# EasyEDA Pro project ProPrj_3x3motorFPGA_V2_1_2025-08-05.epro, schematic motor_drv
Create Date: 2025-05-27; Page Name: P1; Project Name: 3x3motors_d; Schematic Name: motor_drv; Update Date: 2025-05-28; Company: EasyEDA.com; Page Size: A4; Version: V1.0
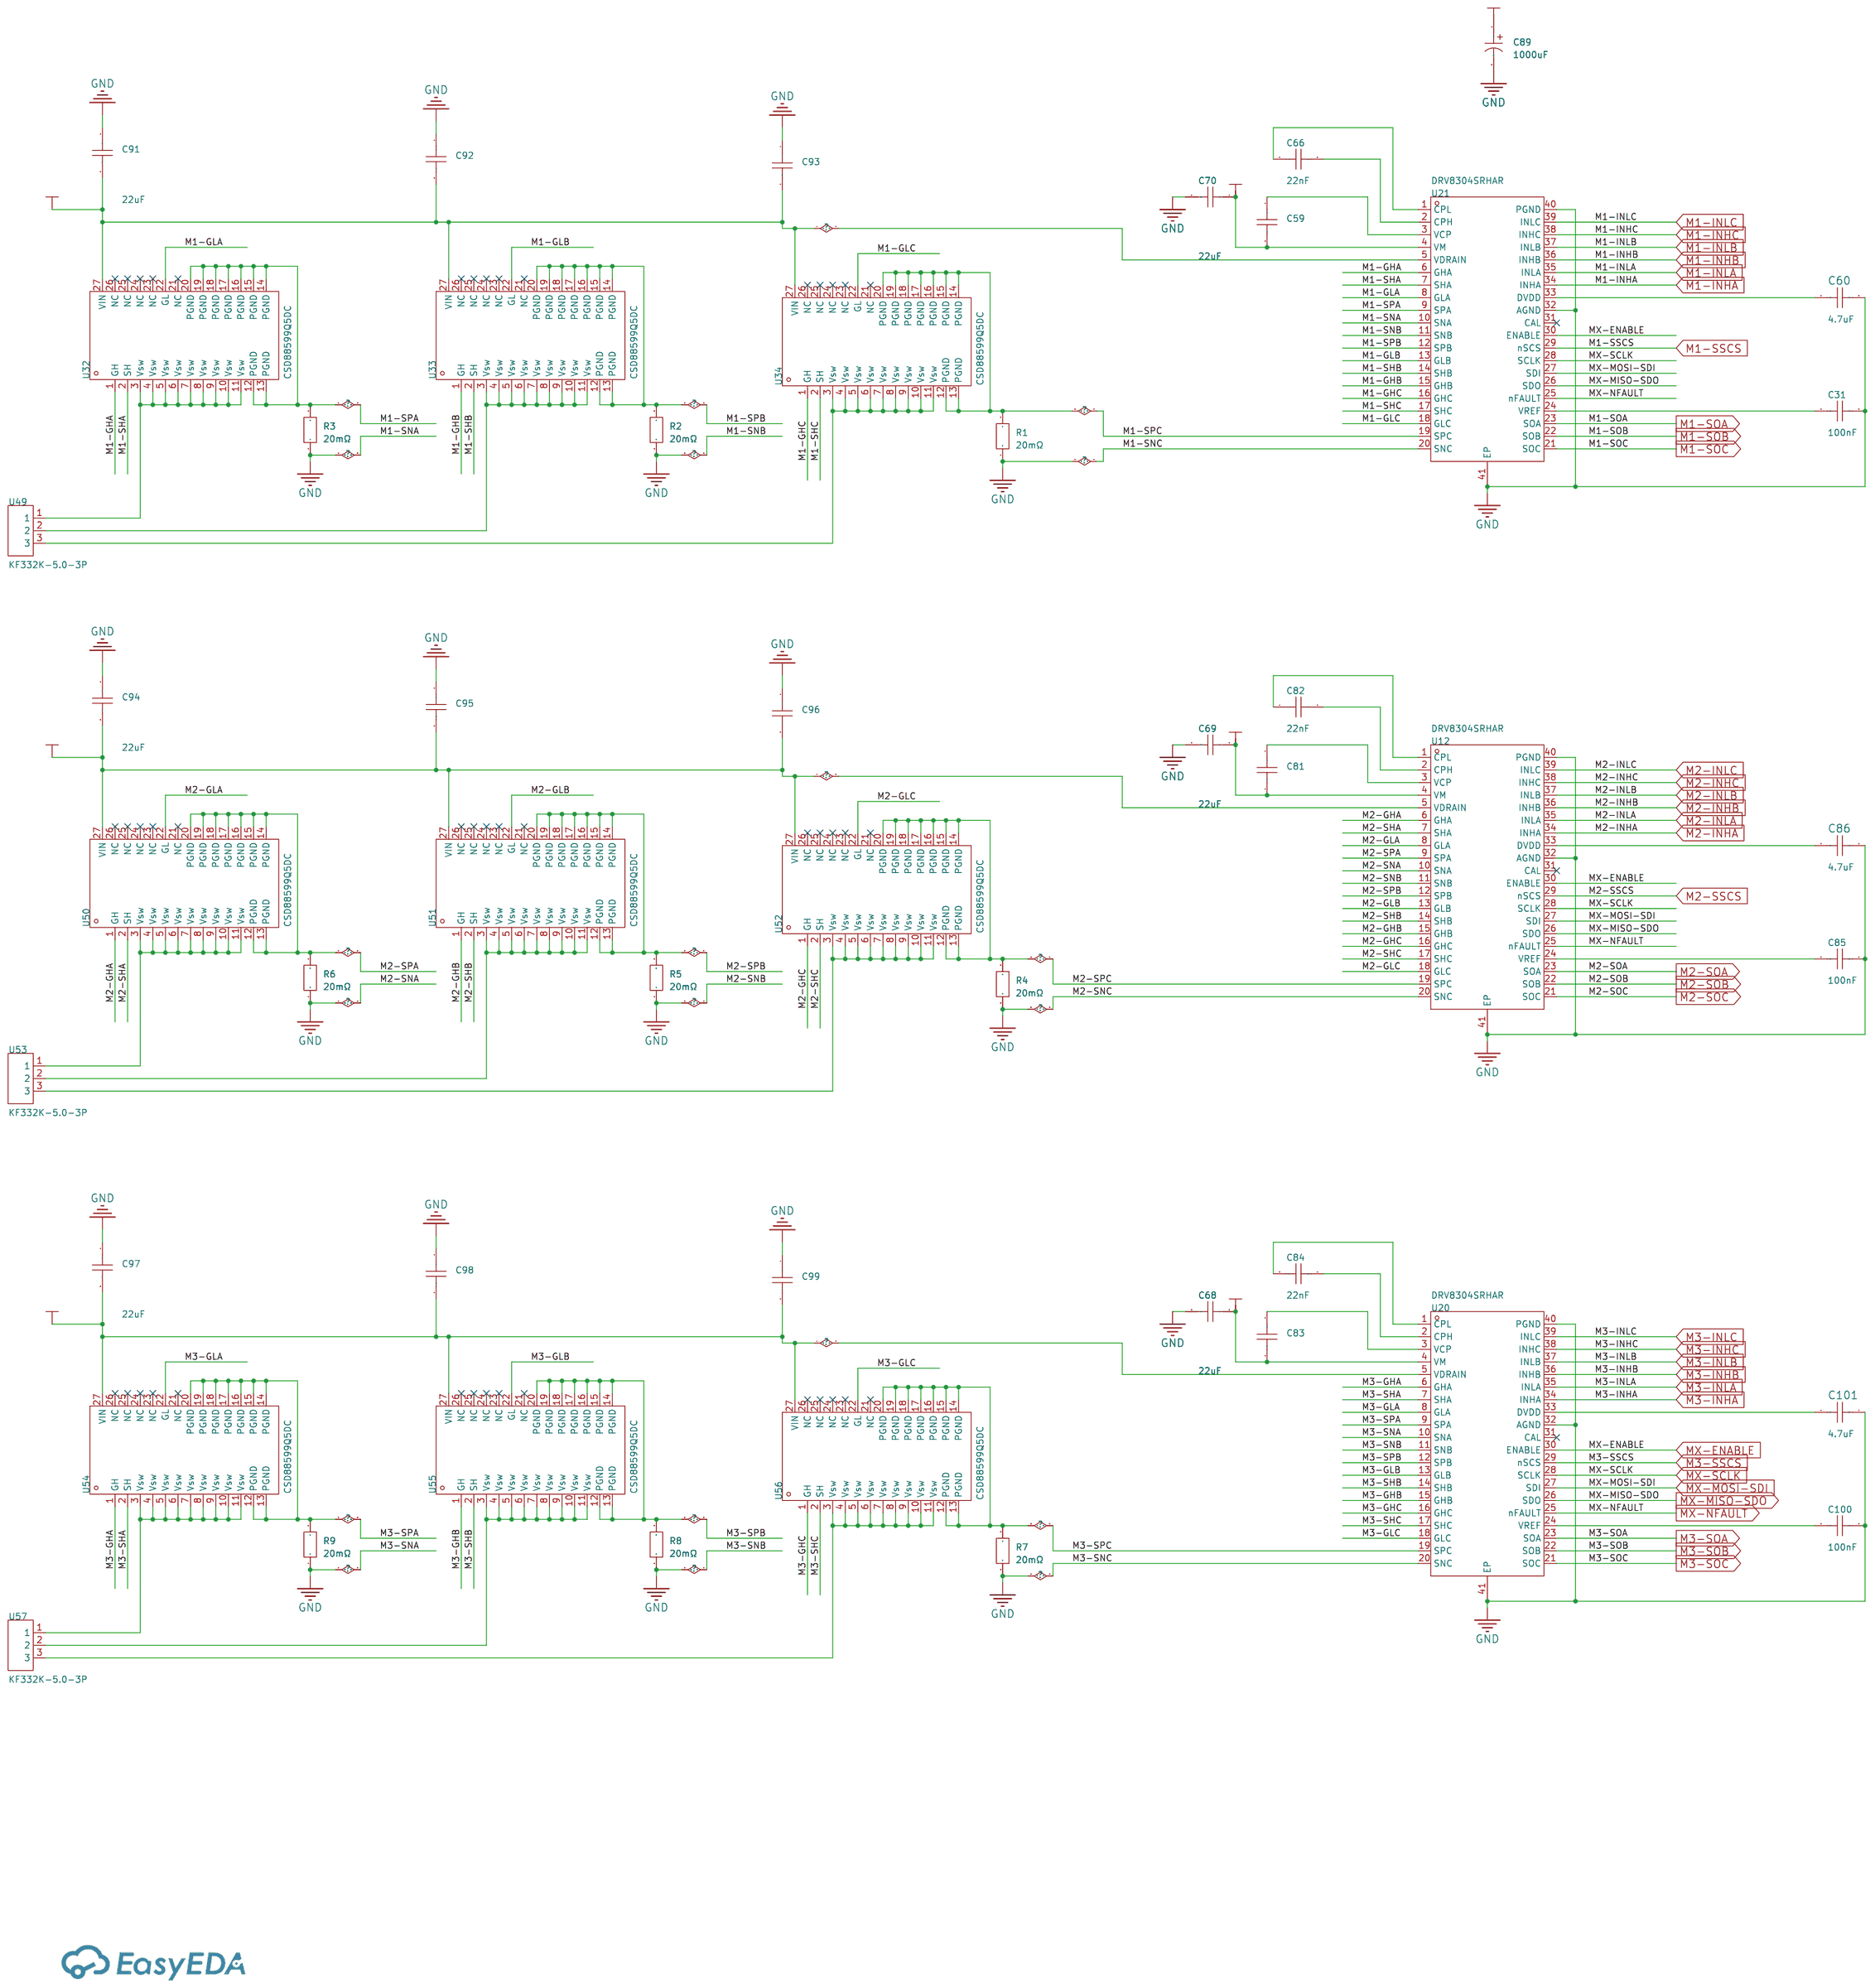
[diagram p5: schematic sheet]

## Parts
C31  100nF  [C0402]
C59  1uF  [C1206]
C60  4.7uF  [C0402]
C66  22nF  [C0805]
C68  22uF  [C2220]
C69  22uF  [C2220]
C70  22uF  [C2220]
C81  1uF  [C1206]
C82  22nF  [C0805]
C83  1uF  [C1206]
C84  22nF  [C0805]
C85  100nF  [C0402]
C86  4.7uF  [C0402]
C89  1000uF  [CAP-TH_BD13.0-P5.00-D0.6-FD]
C91  22uF  [C2220]
C92  1uF  [C1206]
C93  1uF  [C1206]
C94  22uF  [C2220]
C95  1uF  [C1206]
C96  1uF  [C1206]
C97  22uF  [C2220]
C98  1uF  [C1206]
C99  1uF  [C1206]
C100  100nF  [C0402]
C101  4.7uF  [C0402]
R1  20mΩ  [RES-SMD_L6.4-W3.2-R2512]
R2  20mΩ  [RES-SMD_L6.4-W3.2-R2512]
R3  20mΩ  [RES-SMD_L6.4-W3.2-R2512]
R4  20mΩ  [RES-SMD_L6.4-W3.2-R2512]
R5  20mΩ  [RES-SMD_L6.4-W3.2-R2512]
R6  20mΩ  [RES-SMD_L6.4-W3.2-R2512]
R7  20mΩ  [RES-SMD_L6.4-W3.2-R2512]
R8  20mΩ  [RES-SMD_L6.4-W3.2-R2512]
R9  20mΩ  [RES-SMD_L6.4-W3.2-R2512]
U12  DRV8304SRHAR  [VQFN-40_L6.0-W6.0-P0.50-TL-EP]
U20  DRV8304SRHAR  [VQFN-40_L6.0-W6.0-P0.50-TL-EP]
U21  DRV8304SRHAR  [VQFN-40_L6.0-W6.0-P0.50-TL-EP]
U32  CSD88599Q5DC  [SON-22_L5.0-W6.0-P0.50-CSD88599Q5DCT]
U33  CSD88599Q5DC  [SON-22_L5.0-W6.0-P0.50-CSD88599Q5DCT]
U34  CSD88599Q5DC  [SON-22_L5.0-W6.0-P0.50-CSD88599Q5DCT]
U49  KF332K-5.0-3P  [CONN-TH_KF332K-5.0-3P]
U50  CSD88599Q5DC  [SON-22_L5.0-W6.0-P0.50-CSD88599Q5DCT]
U51  CSD88599Q5DC  [SON-22_L5.0-W6.0-P0.50-CSD88599Q5DCT]
U52  CSD88599Q5DC  [SON-22_L5.0-W6.0-P0.50-CSD88599Q5DCT]
U53  KF332K-5.0-3P  [CONN-TH_KF332K-5.0-3P]
U54  CSD88599Q5DC  [SON-22_L5.0-W6.0-P0.50-CSD88599Q5DCT]
U55  CSD88599Q5DC  [SON-22_L5.0-W6.0-P0.50-CSD88599Q5DCT]
U56  CSD88599Q5DC  [SON-22_L5.0-W6.0-P0.50-CSD88599Q5DCT]
U57  KF332K-5.0-3P  [CONN-TH_KF332K-5.0-3P]

## Library data of the parts
C31 C85 C100 = CL05B104KB54PNC: Capacitance: Tolerance:±10% Tolerance:±10% Voltage Rated: Temperature Coefficient:; LCSC Part Name: 100nF ±10% 50V; Supplier Part: C307331; Manufacturer: SAMSUNG(三星); Supplier Footprint: 0402; JLCPCB Part Class: Basic Part; Datasheet: https://atta.szlcsc.com/upload/public/pdf/source/20160218/1457707763339.pdf; Supplier: LCSC; Tolerance: ±10%; Check: true
C59 C81 C83 C92 C93 C95 C96 C98 C99 = CL31B105KBHNNNE: Capacitance: Tolerance:±10% Tolerance:±10% Voltage Rated: Temperature Coefficient:; LCSC Part Name: 1uF ±10% 50V; Supplier Part: C1848; Manufacturer: SAMSUNG(三星); Supplier Footprint: 1206; JLCPCB Part Class: Basic Part; Datasheet: https://atta.szlcsc.com/upload/public/pdf/source/20160218/1457707763339.pdf; Supplier: LCSC; Tolerance: ±10%; Check: true
C60 C86 C101 = LMK105BBJ475MVLF: Capacitance: Tolerance:±20% Tolerance:±20% Voltage Rated: Temperature Coefficient:; LCSC Part Name: 4.7uF ±20% 10V; Supplier Part: C386043; Manufacturer: TAIYO YUDEN(太诱); Supplier Footprint: 0402; JLCPCB Part Class: Extended Part; Datasheet: https://atta.szlcsc.com/upload/public/pdf/source/20210525/C2802164_C0429B055888A674C3F00BA74B841C5B.pdf; Supplier: LCSC; Tolerance: ±20%; Check: true
C66 C82 C84 = CL21B223KBANNNC: Capacitance: Tolerance:±10% Tolerance:±10% Voltage Rated: Temperature Coefficient:; LCSC Part Name: 22nF ±10% 50V; Supplier Part: C1729; Manufacturer: SAMSUNG(三星); Supplier Footprint: 0805; JLCPCB Part Class: Basic Part; Datasheet: https://atta.szlcsc.com/upload/public/pdf/source/20160218/1457707763339.pdf; Supplier: LCSC; Tolerance: ±10%
C68-C70 C91 C94 C97 = FS55X226K500EHG: Capacitance:22uF Tolerance:±10% Tolerance:±10% Voltage Rating:50V Temperature Coefficient:X7R; LCSC Part Name: 22uF ±10% 50V; Supplier Part: C784103; Manufacturer: PSA(信昌电陶); Supplier Footprint: 2220; JLCPCB Part Class: Extended Part; Datasheet: https://atta.szlcsc.com/upload/public/pdf/source/20190723/C381466_B1CCDB289216E7EE775C98769E222CFD.pdf; Supplier: LCSC; Tolerance: ±10%; Voltage Rating: 50V; Temperature Coefficient: X7R; Check: true
C89 = 50V1000uF CD288: Capacitance: Tolerance:±20% Tolerance:±20% Rated Voltage: Ripple Current:- Equivalent Series Resistance(ESR):- Lead Spacing: φD: L: Lifetime @ Temp:- Operating Temperature:-40℃~+105℃ Operating Temperature:-40℃~+105℃; LCSC Part Name: 1000uF ±20% 50V; Supplier Part: C2960425; Manufacturer: HRK(鸿瑞凯电子); Supplier Footprint: 插件,D13xL26mm; JLCPCB Part Class: Extended Part; Datasheet: https://atta.szlcsc.com/upload/public/pdf/source/20220228/DED310EF63E6FF368A764400E9E39D2D.pdf; Supplier: LCSC; Tolerance: ±20%; Operating Temperature: -40℃~+105℃
R1-R9 = PA2512FKF7W0R02E: Resistance: Tolerance:±1% Tolerance:±1% Power(Watts): Temperature Coefficient:±100ppm/℃ Temperature Coefficient:±100ppm/℃ Operating Temperature Range:-55℃~+170℃ Operating Temperature Range:-55℃~+170℃; LCSC Part Name: 20mΩ ±1% 2W; Supplier Part: C728347; Manufacturer: YAGEO(国巨); Supplier Footprint: 2512; JLCPCB Part Class: Extended Part; Datasheet: https://atta.szlcsc.com/upload/public/pdf/source/20200824/C728347_AFB5171DDDEA6B04A166CFC660F274D4.pdf; Supplier: LCSC; Tolerance: ±1%; Temperature Coefficient: ±100ppm/℃; Operating Temperature Range: -55℃~+170℃
U12 U20 U21 = DRV8304SRHAR: Driven Configuration:低边；高边 Load Type:MOSFET Number of Drivers:3 Peak Output Current(sink):300mA Peak Output Current(source):150mA Supply Voltage:6V~38V Supply Voltage:6V~38V Rise Time:300ns Fall Time:150ns Operating Temperature:-40℃~+125℃@(Ta) Operating T; Supplier Part: C1849480; Manufacturer: TI(德州仪器); Supplier Footprint: VQFN-40-EP(6x6); JLCPCB Part Class: Extended Part; Datasheet: https://www.ti.com/cn/lit/gpn/drv8304; Supplier: LCSC; Driven Configuration: 低边；高边; Load Type: MOSFET; Number of Drivers: 3; Peak Output Current(sink): 300mA; Peak Output Current(source): 150mA; Supply Voltage: 6V~38V; Rise Time: 300ns; Fall Time: 150ns; Operating Temperature: -40℃~+125℃@(Ta); Check: true
U32-U34 U50-U52 U54-U56 = CSD88599Q5DC: Supplier Part: C2871380; Manufacturer: TI(德州仪器); Supplier Footprint: VSON-22(5x6); JLCPCB Part Class: Extended Part; Datasheet: https://www.ti.com/cn/lit/gpn/csd88599q5dc; Supplier: LCSC; Check: true
U49 U53 U57 = KF332K-5.0-3P: Number of Positions or Pins:1x3P Pitch:5mm Color:Blue Mounting Type:- Number of Pins:3P Number of Rows:1 Number of PINs Per Row:3 Current Rating:17A Voltage Rating (Max):250V Wire Gauge - AWG:14~22 Wire Gauge - AWG:14~22 Wire Gauge - mm2:1.5 Wire Gauge -; LCSC Part Name: 5mm 1x3P 排数:1 每排P数:3; Supplier Part: C474890; Manufacturer: KEFA(科发); Supplier Footprint: P=5mm; JLCPCB Part Class: Extended Part; Datasheet: https://atta.szlcsc.com/upload/public/pdf/source/20230317/632E84D952AAF2B2AFA9AB805C5CD229.pdf; Supplier: LCSC; Number of Positions or Pins: 1x3P; Pitch: 5mm; Color: Blue; Number of Pins: 3P; Number of Rows: 1; Number of PINs Per Row: 3; Current Rating: 17A; Voltage Rating (Max): 250V; Wire Gauge - AWG: 14~22; Wire Gauge - mm2: 1.5; Operating Temperature: -30℃~+120℃; Check: true

## Nets
36V: C59.2 C68.1 C69.1 C70.1 C81.2 C83.2 C89.1 C91.2 C92.2 C93.2 C94.2 C95.2 C96.2 C97.2 C98.2 C99.2 U12.4(VM) U12.5(VDRAIN) U20.4(VM) U20.5(VDRAIN) U21.4(VM) U21.5(VDRAIN) U32.27(VIN) U33.27(VIN) U34.27(VIN) U50.27(VIN) U51.27(VIN) U52.27(VIN) U54.27(VIN) U55.27(VIN) U56.27(VIN)
GND: C31.2 C60.2 C68.2 C69.2 C70.2 C85.2 C86.2 C89.2 C91.1 C92.1 C93.1 C94.1 C95.1 C96.1 C97.1 C98.1 C99.1 C100.2 C101.2 R1.1 R2.1 R3.1 R4.1 R5.1 R6.1 R7.1 R8.1 R9.1 U12.10(SNA) U12.11(SNB) U12.20(SNC) U12.32(AGND) U12.40(PGND) U12.41(EP) U20.10(SNA) U20.11(SNB) U20.20(SNC) U20.32(AGND) U20.40(PGND) U20.41(EP) U21.10(SNA) U21.11(SNB) U21.20(SNC) U21.32(AGND) U21.40(PGND) U21.41(EP)
M1-GHA: U21.6(GHA) U32.1(GH)
M1-GHB: U21.15(GHB) U33.1(GH)
M1-GHC: U21.16(GHC) U34.1(GH)
M1-GLA: U21.8(GLA) U32.22(GL)
M1-GLB: U21.13(GLB) U33.22(GL)
M1-GLC: U21.18(GLC) U34.22(GL)
M1-INHA: U21.34(INHA)
M1-INHB: U21.36(INHB)
M1-INHC: U21.38(INHC)
M1-INLA: U21.35(INLA)
M1-INLB: U21.37(INLB)
M1-INLC: U21.39(INLC)
M1-SHA: U21.7(SHA) U32.2(SH)
M1-SHB: U21.14(SHB) U33.2(SH)
M1-SHC: U21.17(SHC) U34.2(SH)
M1-SOA: U21.23(SOA)
M1-SOB: U21.22(SOB)
M1-SOC: U21.21(SOC)
M1-SPA: R3.2 U21.9(SPA) U32.12(PGND) U32.13(PGND) U32.14(PGND) U32.15(PGND) U32.16(PGND) U32.17(PGND) U32.18(PGND) U32.19(PGND) U32.20(PGND)
M1-SPB: R2.2 U21.12(SPB) U33.12(PGND) U33.13(PGND) U33.14(PGND) U33.15(PGND) U33.16(PGND) U33.17(PGND) U33.18(PGND) U33.19(PGND) U33.20(PGND)
M1-SPC: R1.2 U21.19(SPC) U34.12(PGND) U34.13(PGND) U34.14(PGND) U34.15(PGND) U34.16(PGND) U34.17(PGND) U34.18(PGND) U34.19(PGND) U34.20(PGND)
M1-SSCS: U21.29(nSCS)
M2-GHA: U12.6(GHA) U50.1(GH)
M2-GHB: U12.15(GHB) U51.1(GH)
M2-GHC: U12.16(GHC) U52.1(GH)
M2-GLA: U12.8(GLA) U50.22(GL)
M2-GLB: U12.13(GLB) U51.22(GL)
M2-GLC: U12.18(GLC) U52.22(GL)
M2-INHA: U12.34(INHA)
M2-INHB: U12.36(INHB)
M2-INHC: U12.38(INHC)
M2-INLA: U12.35(INLA)
M2-INLB: U12.37(INLB)
M2-INLC: U12.39(INLC)
M2-SHA: U12.7(SHA) U50.2(SH)
M2-SHB: U12.14(SHB) U51.2(SH)
M2-SHC: U12.17(SHC) U52.2(SH)
M2-SOA: U12.23(SOA)
M2-SOB: U12.22(SOB)
M2-SOC: U12.21(SOC)
M2-SPA: R6.2 U12.9(SPA) U50.12(PGND) U50.13(PGND) U50.14(PGND) U50.15(PGND) U50.16(PGND) U50.17(PGND) U50.18(PGND) U50.19(PGND) U50.20(PGND)
M2-SPB: R5.2 U12.12(SPB) U51.12(PGND) U51.13(PGND) U51.14(PGND) U51.15(PGND) U51.16(PGND) U51.17(PGND) U51.18(PGND) U51.19(PGND) U51.20(PGND)
M2-SPC: R4.2 U12.19(SPC) U52.12(PGND) U52.13(PGND) U52.14(PGND) U52.15(PGND) U52.16(PGND) U52.17(PGND) U52.18(PGND) U52.19(PGND) U52.20(PGND)
M2-SSCS: U12.29(nSCS)
M3-GHA: U20.6(GHA) U54.1(GH)
M3-GHB: U20.15(GHB) U55.1(GH)
M3-GHC: U20.16(GHC) U56.1(GH)
M3-GLA: U20.8(GLA) U54.22(GL)
M3-GLB: U20.13(GLB) U55.22(GL)
M3-GLC: U20.18(GLC) U56.22(GL)
M3-INHA: U20.34(INHA)
M3-INHB: U20.36(INHB)
M3-INHC: U20.38(INHC)
M3-INLA: U20.35(INLA)
M3-INLB: U20.37(INLB)
M3-INLC: U20.39(INLC)
M3-SHA: U20.7(SHA) U54.2(SH)
M3-SHB: U20.14(SHB) U55.2(SH)
M3-SHC: U20.17(SHC) U56.2(SH)
M3-SOA: U20.23(SOA)
M3-SOB: U20.22(SOB)
M3-SOC: U20.21(SOC)
M3-SPA: R9.2 U20.9(SPA) U54.12(PGND) U54.13(PGND) U54.14(PGND) U54.15(PGND) U54.16(PGND) U54.17(PGND) U54.18(PGND) U54.19(PGND) U54.20(PGND)
M3-SPB: R8.2 U20.12(SPB) U55.12(PGND) U55.13(PGND) U55.14(PGND) U55.15(PGND) U55.16(PGND) U55.17(PGND) U55.18(PGND) U55.19(PGND) U55.20(PGND)
M3-SPC: R7.2 U20.19(SPC) U56.12(PGND) U56.13(PGND) U56.14(PGND) U56.15(PGND) U56.16(PGND) U56.17(PGND) U56.18(PGND) U56.19(PGND) U56.20(PGND)
M3-SSCS: U20.29(nSCS)
MX-ENABLE: U12.30(ENABLE) U20.30(ENABLE) U21.30(ENABLE)
MX-MISO-SDO: U12.26(SDO) U20.26(SDO) U21.26(SDO)
MX-MOSI-SDI: U12.27(SDI) U20.27(SDI) U21.27(SDI)
MX-NFAULT: U12.25(nFAULT) U20.25(nFAULT) U21.25(nFAULT)
MX-SCLK: U12.28(SCLK) U20.28(SCLK) U21.28(SCLK)
Net-(C31-1): C31.1 U21.24(VREF)
Net-(C59-1): C59.1 U21.3(VCP)
Net-(C60-1): C60.1 U21.33(DVDD)
Net-(C66-1): C66.1 U21.1(CPL)
Net-(C66-2): C66.2 U21.2(CPH)
Net-(C81-1): C81.1 U12.3(VCP)
Net-(C82-1): C82.1 U12.1(CPL)
Net-(C82-2): C82.2 U12.2(CPH)
Net-(C83-1): C83.1 U20.3(VCP)
Net-(C84-1): C84.1 U20.1(CPL)
Net-(C84-2): C84.2 U20.2(CPH)
Net-(C85-1): C85.1 U12.24(VREF)
Net-(C86-1): C86.1 U12.33(DVDD)
Net-(C100-1): C100.1 U20.24(VREF)
Net-(C101-1): C101.1 U20.33(DVDD)
Net-(U32-3): U32.3(Vsw) U32.4(Vsw) U32.5(Vsw) U32.6(Vsw) U32.7(Vsw) U32.8(Vsw) U32.9(Vsw) U32.10(Vsw) U32.11(Vsw) U49.1
Net-(U33-3): U33.3(Vsw) U33.4(Vsw) U33.5(Vsw) U33.6(Vsw) U33.7(Vsw) U33.8(Vsw) U33.9(Vsw) U33.10(Vsw) U33.11(Vsw) U49.2
Net-(U34-3): U34.3(Vsw) U34.4(Vsw) U34.5(Vsw) U34.6(Vsw) U34.7(Vsw) U34.8(Vsw) U34.9(Vsw) U34.10(Vsw) U34.11(Vsw) U49.3
Net-(U50-3): U50.3(Vsw) U50.4(Vsw) U50.5(Vsw) U50.6(Vsw) U50.7(Vsw) U50.8(Vsw) U50.9(Vsw) U50.10(Vsw) U50.11(Vsw) U53.1
Net-(U51-3): U51.3(Vsw) U51.4(Vsw) U51.5(Vsw) U51.6(Vsw) U51.7(Vsw) U51.8(Vsw) U51.9(Vsw) U51.10(Vsw) U51.11(Vsw) U53.2
Net-(U52-3): U52.3(Vsw) U52.4(Vsw) U52.5(Vsw) U52.6(Vsw) U52.7(Vsw) U52.8(Vsw) U52.9(Vsw) U52.10(Vsw) U52.11(Vsw) U53.3
Net-(U54-3): U54.3(Vsw) U54.4(Vsw) U54.5(Vsw) U54.6(Vsw) U54.7(Vsw) U54.8(Vsw) U54.9(Vsw) U54.10(Vsw) U54.11(Vsw) U57.1
Net-(U55-3): U55.3(Vsw) U55.4(Vsw) U55.5(Vsw) U55.6(Vsw) U55.7(Vsw) U55.8(Vsw) U55.9(Vsw) U55.10(Vsw) U55.11(Vsw) U57.2
Net-(U56-3): U56.3(Vsw) U56.4(Vsw) U56.5(Vsw) U56.6(Vsw) U56.7(Vsw) U56.8(Vsw) U56.9(Vsw) U56.10(Vsw) U56.11(Vsw) U57.3

Not connected (* = marked no-connect by the designer): U12 31(CAL)*; U20 31(CAL)*; U21 31(CAL)*; U32 21(NC)* 23(NC)* 24(NC)* 25(NC)* 26(NC)*; U33 21(NC)* 23(NC)* 24(NC)* 25(NC)* 26(NC)*; U34 21(NC)* 23(NC)* 24(NC)* 25(NC)* 26(NC)*; U50 21(NC)* 23(NC)* 24(NC)* 25(NC)* 26(NC)*; U51 21(NC)* 23(NC)* 24(NC)* 25(NC)* 26(NC)*; U52 21(NC)* 23(NC)* 24(NC)* 25(NC)* 26(NC)*; U54 21(NC)* 23(NC)* 24(NC)* 25(NC)* 26(NC)*; U55 21(NC)* 23(NC)* 24(NC)* 25(NC)* 26(NC)*; U56 21(NC)* 23(NC)* 24(NC)* 25(NC)* 26(NC)*
